# EAGLE schematic power supply (EAGLE 7.1.0)
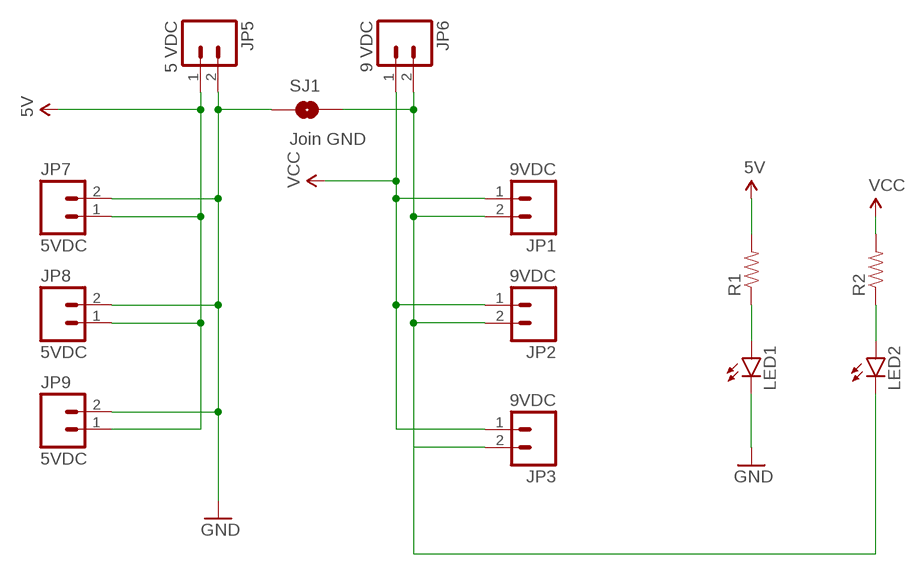
[diagram p0: schematic, sheet 1]

## Parts
JP1  9VDC  M02PTH  [1X02]
JP2  9VDC  M02PTH  [1X02]
JP3  9VDC  M02PTH  [1X02]
JP5  5 VDC  M025MM  [SCREWTERMINAL-5MM-2]
JP6  9 VDC  M025MM  [SCREWTERMINAL-5MM-2]
JP7  5VDC  M02PTH  [1X02]
JP8  5VDC  M02PTH  [1X02]
JP9  5VDC  M02PTH  [1X02]
LED1  LED3MM  [LED3MM]
LED2  LED3MM  [LED3MM]
R1  RESISTORAXIAL-0.3  [AXIAL-0.3]
R2  RESISTORAXIAL-0.3  [AXIAL-0.3]
SJ1  Join GND  SOLDERJUMPERNO  [SJ_2S-NO]

## Nets
5V: JP5.1 JP7.1 JP8.1 JP9.1 R1.P$2
GND: JP5.2 JP7.2 JP8.2 JP9.2 LED1.K(C) SJ1.1
N$1: LED1.A R1.P$1
N$3: LED2.A R2.P$1
N$4: JP1.2 JP2.2 JP3.2 JP6.2 LED2.K(C) SJ1.2
VCC: JP1.1 JP2.1 JP3.1 JP6.1 R2.P$2

## Library data of the parts
JP1-JP3 JP7-JP9 = SparkFun-Connectors:M02: Standard 2-pin 0.1" header. Use with - straight break away headers ( PRT-00116) - right angle break away headers (PRT-00553) - swiss pins (PRT-00743) - machine pins (PRT-00117) - female headers (PRT-00115) Molex polarized connector foot print use with: PRT-08233 with associated crimp pins and housings. 2.54_SCREWTERM for use with PRT-10571. 3.5mm Screw Terminal footprints for PRT-08084 5mm Screw Terminal footprints for use with PRT-08432
JP5 JP6 = SparkFun-Connectors:M02: Standard 2-pin 0.1" header. Use with - straight break away headers ( PRT-00116) - right angle break away headers (PRT-00553) - swiss pins (PRT-00743) - machine pins (PRT-00117) - female headers (PRT-00115) Molex polarized connector foot print use with: PRT-08233 with associated crimp pins and housings. 2.54_SCREWTERM for use with PRT-10571. 3.5mm Screw Terminal footprints for PRT-08084 5mm Screw Terminal footprints for use with PRT-08432; STOREFRONT_ID: PRT-08432
LED1 LED2 = SparkFun-LED:LED: LEDs Standard schematic elements and footprints for 5mm, 3mm, 1206, and 0603 sized LEDs. 5mm - Spark Fun Electronics SKU : COM-00529 (and others)
R1 R2 = SparkFun-Resistors:RESISTOR: Resistor Basic schematic elements and footprints for 0603, 1206, and PTH resistors.
SJ1 = SparkFun-Retired:SOLDERJUMPER: Solder Jumper Standard SMD solder jumper. Used to automate production. Two varients : Normally Open and Normally Closed are the same, but have different paste layers. NC will have a large amount of paste and should jumper during reflow.